# EAGLE design Orone-mini-S8H-v0r001 (EAGLE 6.4)
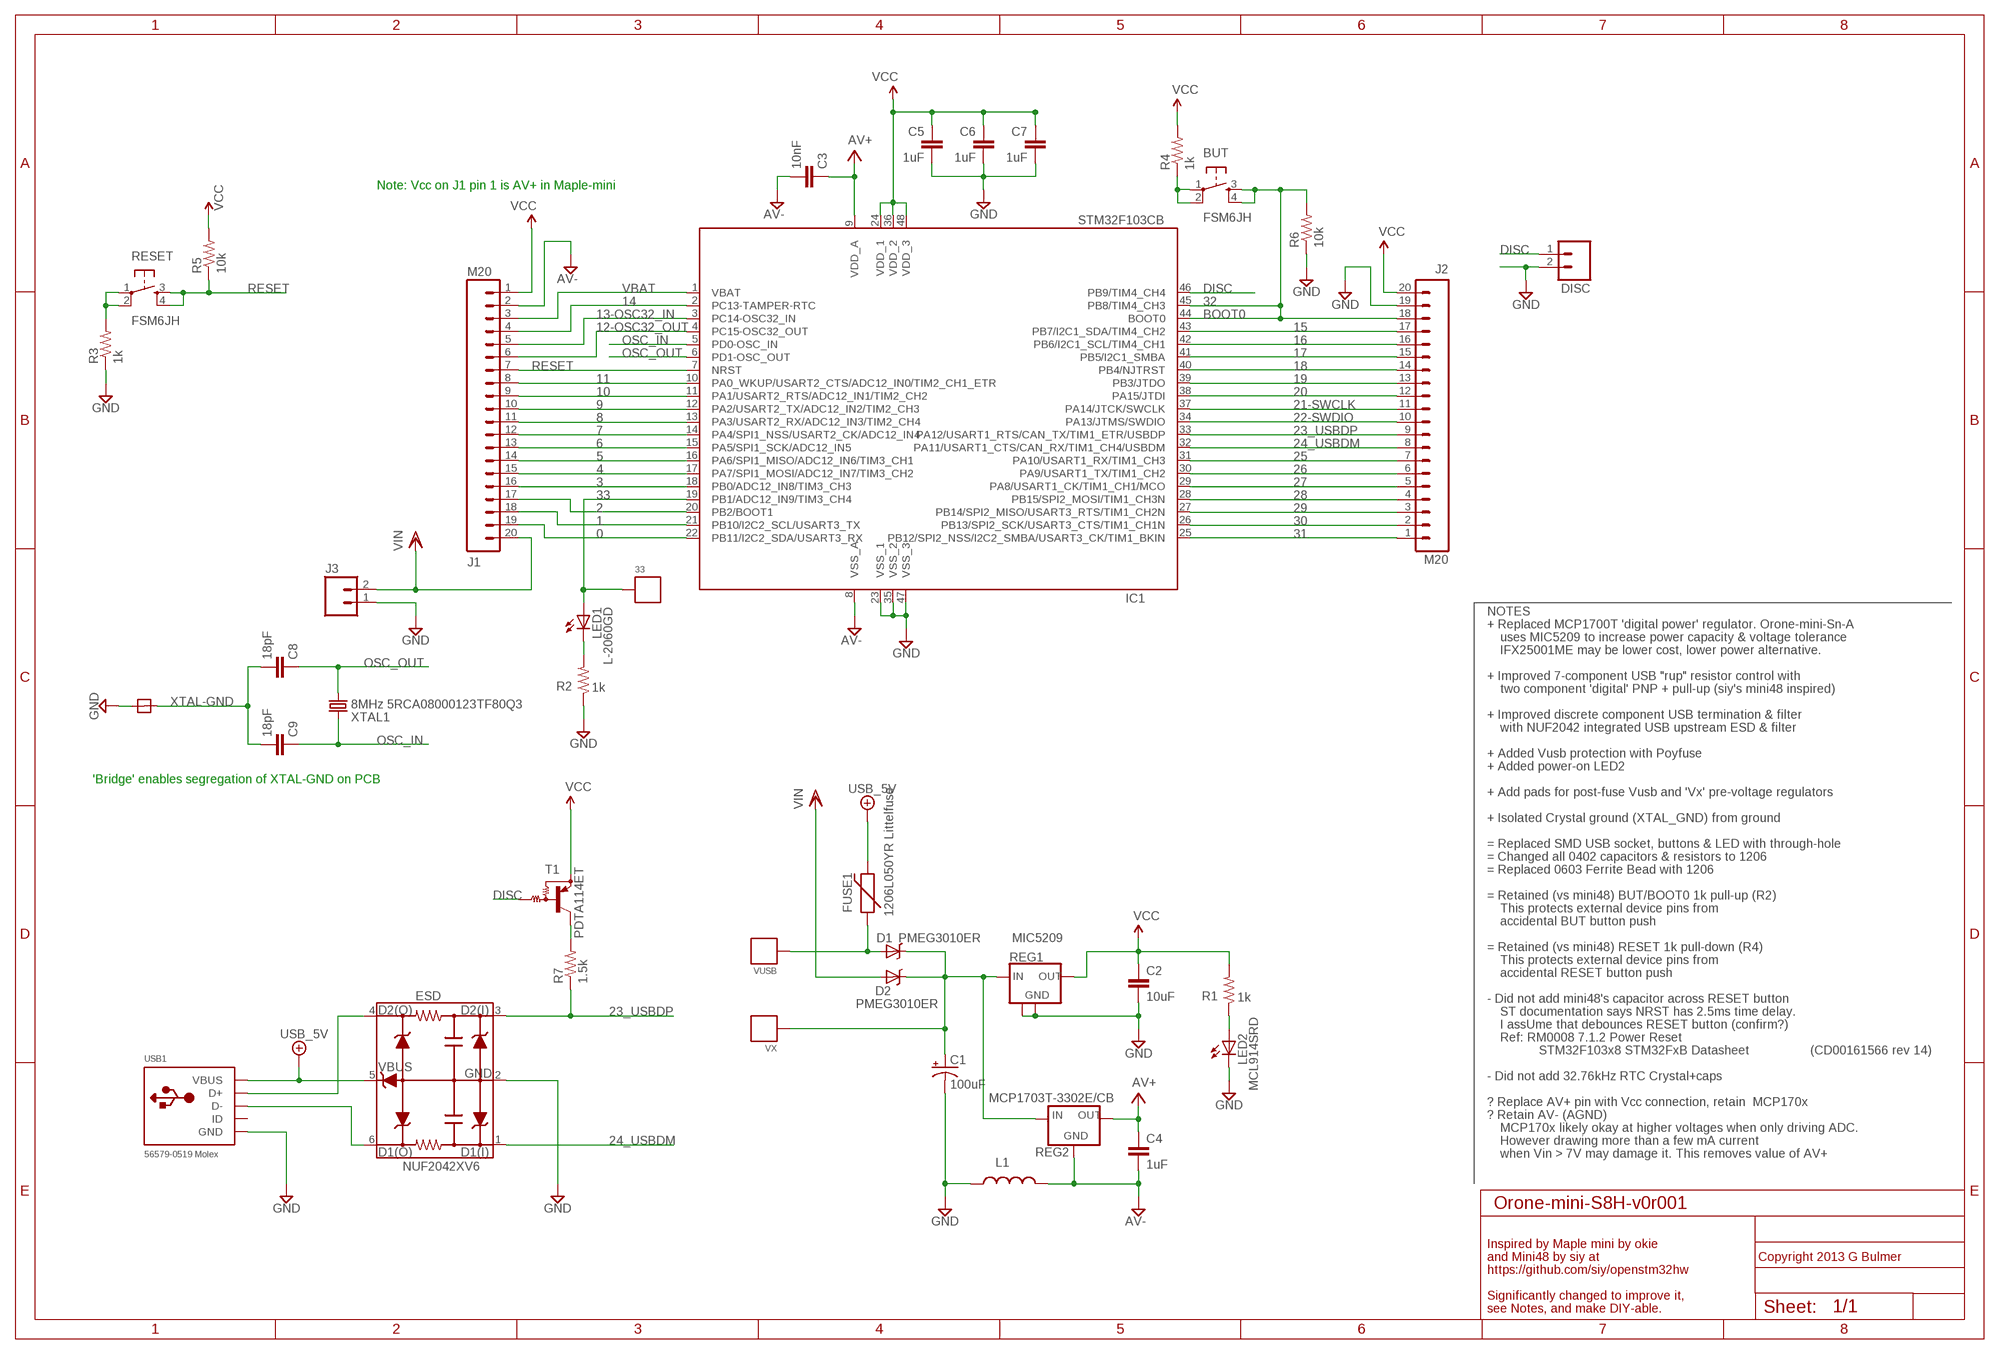
[diagram p0: schematic, sheet 1]

## Parts
33  SIGNAL-PIN1  [1PIN]
BUT  FSM6JH  TAC_SWITCHPTH  [TACTILE-PTH]
C1  100uF  CAP_POL7343  [EIA7343]
C2  10uF  CAP1206  [1206]
C3  10nF  CAP1206  [1206]
C4  1uF  CAP1206  [1206]
C5  1uF  CAP1206  [1206]
C6  1uF  CAP1206  [1206]
C7  1uF  CAP1206  [1206]
C8  18pF  CAP1206  [1206]
C9  18pF  CAP1206  [1206]
D1  PMEG3010ER  DIODE-SCHOTTKYSOD-123W  [SOD-123W]
D2  PMEG3010ER  DIODE-SCHOTTKYSOD-123W  [SOD-123W]
DISC  M021X02_NO_SILK  [1X02_NO_SILK]
ESD  NUF2042XV6  NUF2042XV6SOT563  [SOT563]
FUSE1  1206L050YR Littelfuse  PTCSMD  [PTC-1206]
IC1  STM32F103CB  [LQFP48]
J1  M20  [1X20]
J2  M20  [1X20]
J3  M02POLAR  [MOLEX-1X2]
L1  INDUCTOR1206  [1206]
LED1  L-2060GD  LED1.8MM-1MM  [LED1.8MM-1MM]
LED2  MCL914SRD  LED1.8MM-1MM  [LED1.8MM-1MM]
R1  1k  RESISTOR1206  [1206]
R2  1k  RESISTOR1206  [1206]
R3  1k  RESISTOR1206  [1206]
R4  1k  RESISTOR1206  [1206]
R5  10k  RESISTOR1206  [1206]
R6  10k  RESISTOR1206  [1206]
R7  1.5k  RESISTOR1206  [1206]
REG1  MIC5209  V_REG_LM2937SOT223-NT  [SOT223-NT]
REG2  MCP1703T-3302E/CB  MCP170XSOT23  [SOT23]
RESET  FSM6JH  TAC_SWITCHPTH  [TACTILE-PTH]
T1  PDTA114ET  ES_PNP-DRIVERSOT23-3  [ES_SOT23-3]
U$4  2PIN-GND-BRIDGE08X08MILS  [2PIN-08X08]
USB1  56579-0519 Molex  USB-MINIBTH-DRILL  [USB-MINI-AB-TH-MOLEX-DRILL]
VUSB  SIGNAL-PIN1  [1PIN]
VX  SIGNAL-PIN1  [1PIN]
XTAL1  8MHz 5RCA08000123TF80Q3  CRYSTAL5X3  [CRYSTAL-SMD-5X3]

## Nets
0: IC1.22(PB11/I2C2_SDA/USART3_RX) J1.19
1: IC1.21(PB10/I2C2_SCL/USART3_TX) J1.18
2: IC1.20(PB2/BOOT1) J1.17
3: IC1.18(PB0/ADC12_IN8/TIM3_CH3) J1.16
4: IC1.17(PA7/SPI1_MOSI/ADC12_IN7/TIM3_CH2) J1.15
5: IC1.16(PA6/SPI1_MISO/ADC12_IN6/TIM3_CH1) J1.14
6: IC1.15(PA5/SPI1_SCK/ADC12_IN5) J1.13
7: IC1.14(PA4/SPI1_NSS/USART2_CK/ADC12_IN4) J1.12
8: IC1.13(PA3/USART2_RX/ADC12_IN3/TIM2_CH4) J1.11
9: IC1.12(PA2/USART2_TX/ADC12_IN2/TIM2_CH3) J1.10
10: IC1.11(PA1/USART2_RTS/ADC12_IN1/TIM2_CH2) J1.9
11: IC1.10(PA0_WKUP/USART2_CTS/ADC12_IN0/TIM2_CH1_ETR) J1.8
12-OSC32_OUT: IC1.4(PC15-OSC32_OUT) J1.6
13-OSC32_IN: IC1.3(PC14-OSC32_IN) J1.5
14: IC1.2(PC13-TAMPER-RTC) J1.4
15: IC1.43(PB7/I2C1_SDA/TIM4_CH2) J2.17
16: IC1.42(PB6/I2C1_SCL/TIM4_CH1) J2.16
17: IC1.41(PB5/I2C1_SMBA) J2.15
18: IC1.40(PB4/NJTRST) J2.14
19: IC1.39(PB3/JTDO) J2.13
20: IC1.38(PA15/JTDI) J2.12
21-SWCLK: IC1.37(PA14/JTCK/SWCLK) J2.11
22-SWDIO: IC1.34(PA13/JTMS/SWDIO) J2.10
23_USBDP: ESD.3(D2(I)) IC1.33(PA12/USART1_RTS/CAN_TX/TIM1_ETR/USBDP) J2.9 R7.1
24_USBDM: ESD.1(D1(I)) IC1.32(PA11/USART1_CTS/CAN_RX/TIM1_CH4/USBDM) J2.8
25: IC1.31(PA10/USART1_RX/TIM1_CH3) J2.7
26: IC1.30(PA9/USART1_TX/TIM1_CH2) J2.6
27: IC1.29(PA8/USART1_CK/TIM1_CH1/MCO) J2.5
28: IC1.28(PB15/SPI2_MOSI/TIM1_CH3N) J2.4
29: IC1.27(PB14/SPI2_MISO/USART3_RTS/TIM1_CH2N) J2.3
30: IC1.26(PB13/SPI2_SCK/USART3_CTS/TIM1_CH1N) J2.2
31: IC1.25(PB12/SPI2_NSS/I2C2_SMBA/USART3_CK/TIM1_BKIN) J2.1
32: BUT.3 BUT.4 IC1.44(BOOT0) IC1.45(PB8/TIM4_CH3) J2.18 R6.2
33: 33.P$1 IC1.19(PB1/ADC12_IN9/TIM3_CH4) LED1.A
+5V/2: ESD.5(VBUS) FUSE1.2 USB1.VBUS ; supply symbol labelled USB_5V
AV+: C3.1 C4.1 IC1.9(VDD_A) REG2.2(OUT)
AV-: C3.2 C4.2 IC1.8(VSS_A) J1.2 L1.2 REG2.1(GND)
DGND: C1.C(-) C2.2 C5.2 C6.2 C7.2 DISC.2 ESD.2(GND) IC1.23(VSS_1) IC1.35(VSS_2) IC1.47(VSS_3) J2.19 J3.1 L1.1 LED2.C R2.1 R3.1 R6.1 REG1.2(GND) REG1.4(GND) U$4.P$1 USB1.GND ; supply symbol labelled GND
DISC: DISC.1 IC1.46(PB9/TIM4_CH4) T1.1(B)
N$1: BUT.1 BUT.2 R4.1
N$2: LED1.C R2.2
N$3: D1.P$2.ANODE(A) FUSE1.1 VUSB.P$1
N$4: R3.2 RESET.1 RESET.2
N$6: LED2.A R1.1
N$7: C1.A(+) D1.P$1.CATHODE(C) D2.P$1.CATHODE(C) REG1.1(IN) REG2.3(IN) VX.P$1
N$51: R7.2 T1.3(C)
N$59: ESD.4(D2(O)) USB1.D+
N$60: ESD.6(D1(O)) USB1.D-
OSC_IN: C9.1 IC1.5(PD0-OSC_IN) XTAL1.3
OSC_OUT: C8.1 IC1.6(PD1-OSC_OUT) XTAL1.1
RESET: IC1.7(NRST) J1.7 R5.1 RESET.3 RESET.4
VBAT: IC1.1(VBAT) J1.3
VCC: C2.1 C5.1 C6.1 C7.1 IC1.24(VDD_1) IC1.36(VDD_2) IC1.48(VDD_3) J1.1 J2.20 R1.2 R4.2 R5.2 REG1.3(OUT) T1.2(E)
VIN: D2.P$2.ANODE(A) J1.20 J3.2
XTAL-GND: C8.2 C9.2 U$4.P$2
Unconnected: USB1.ID

## Notes on the sheet
- Note: Vcc on J1 pin 1 is AV+ in Maple-mini
- BOOT0
- NOTES
- + Replaced MCP1700T 'digital power' regulator. Orone-mini-Sn-A
- uses MIC5209 to increase power capacity & voltage tolerance
- IFX25001ME may be lower cost, lower power alternative.
- + Improved 7-component USB "rup" resistor control with
- two component 'digital' PNP + pull-up (siy's mini48 inspired)
- + Improved discrete component USB termination & filter
- with NUF2042 integrated USB upstream ESD & filter
- + Added Vusb protection with Poyfuse
- + Added power-on LED2
- 'Bridge' enables segregation of XTAL-GND on PCB
- + Add pads for post-fuse Vusb and 'Vx' pre-voltage regulators
- + Isolated Crystal ground (XTAL_GND) from ground
- = Replaced SMD USB socket, buttons & LED with through-hole
- = Changed all 0402 capacitors & resistors to 1206
- = Replaced 0603 Ferrite Bead with 1206
- = Retained (vs mini48) BUT/BOOT0 1k pull-up (R2)
- This protects external device pins from
- accidental BUT button push
- = Retained (vs mini48) RESET 1k pull-down (R4)
- This protects external device pins from
- accidental RESET button push
- - Did not add mini48's capacitor across RESET button
- ST documentation says NRST has 2.5ms time delay.
- I assUme that debounces RESET button (confirm?)
- Ref: RM0008 7.1.2 Power Reset
- STM32F103x8 STM32FxB Datasheet | (CD00161566 rev 14)
- - Did not add 32.76kHz RTC Crystal+caps
- ? Replace AV+ pin with Vcc connection, retain  MCP170x
- ? Retain AV- (AGND)
- MCP170x likely okay at higher voltages when only driving ADC.
- However drawing more than a few mA current
- when Vin > 7V may damage it. This removes value of AV+
- Inspired by Maple mini by okie
- and Mini48 by siy at | Copyright 2013 G Bulmer
- https://github.com/siy/openstm32hw
- Significantly changed to improve it,
- see Notes, and make DIY-able.

## Library data of the parts
33 VUSB VX = signal-pins:SIGNAL-PIN1
BUT RESET = SparkFun:TAC_SWITCH: Momentary Switch Button commonly used for reset or general input. Spark Fun Electronics SKU : COM-00097
C1 = SparkFun:CAP_POL: Capacitor Polarized These are standard SMD and PTH capacitors. Normally 10uF, 47uF, and 100uF in electrolytic and tantalum varieties. Always verify the external diameter of the through hole cap, it varies with capacity, voltage, and manufacturer. The EIA devices should be standard.
C2-C9 = SMD-passives-gb01:CAP: Capacitor Standard 1206 SMD ceramic capacitor
D1 D2 = diode-schottky:DIODE-SCHOTTKY
DISC J3 = SparkFun:M02: Header 2 Standard 2-pin 0.1" header. Use with straight break away headers (SKU : PRT-00116), right angle break away headers (PRT-00553), swiss pins (PRT-00743), machine pins (PRT-00117), and female headers (PRT-00115). Molex polarized connector foot print use with SKU : PRT-08233 with associated crimp pins and housings.
ESD = USB-ESD-protection:NUF2042XV6: NUF2042XV6 - USB ESD protection, and Full-speed USB termination. Resistor values are 22ohm. Capacitor values are 42pF.
FUSE1 = SparkFun:PTC: Resettable Fuse PTC Resettable Fuse. Spark Fun Electronics SKU : COM-08357
IC1 = stm32:STM32F103CB
J1 J2 = SparkFun:M20: 20 pin Header Contains both standard and LOCK variants. The lock_special holes are staggared by 5 mil, like the lock variant, except for the last two holes. They are not altered from the "standard" footprint layout. This is used for a special purpose on the layout of our Graphic LCD Backpack. Make sure you want to use this device before selecting it for you project!
L1 = SMD-passives-gb01:INDUCTOR: Inductors This is Sparkfun's Inductor, using the standard resistor/capacitor footprint. It has not been proven. The 1206 footprint also matches the Ferrite Bead footprint for fair-rite at fair-rite.com was http://www.fair-rite.com/cgibin/catalog.pgm?THEAPPL=Suppression+Components&THEWHERE=Board+Component&THEPART=Chip+Beads#select:freq1
LED1 LED2 = LED:LED: LEDs Standard schematic elements and footprints for 5mm, 3mm, 1206, and 0603 sized LEDs. 5mm - Spark Fun Electronics SKU : COM-00529 (and others)
R1-R7 = SMD-passives-gb01:RESISTOR: Resistor Basic schematic elements and footprints for 0603, 1206, and PTH resistors.
REG1 = V_REG_LM2937:V_REG_LM2937: LM2937-footprint LDO Voltage regulator LM2937 500mA minimum 4.75V in 3.3V out: http://www.ti.com/product/lm2937-3.3 or http://www.ti.com/product/lm2937 MIC5209 500mA, 600mV@0.5A dropout voltage (max): http://www.micrel.com/_PDF/mic5209.pdf MIC39100 1A, 630mV@1A dropout voltage (max): http://www.micrel.com/_PDF/mic39100.pdf
REG2 = MCP170x:MCP170X: Microchip MCP170x voltage regulator MCP1702 http://ww1.microchip.com/downloads/en/DeviceDoc/22008E.pdf MCP1703 http://ww1.microchip.com/downloads/en/DeviceDoc/22049f.pdf
T1 = pnp_digital_transistor:ES_PNP-DRIVER
U$4 = senzate-2010-02:2PIN-GND-BRIDGE
USB1 = USB-Mini-Molex:USB-MINIB: USB Connectors USBMINIB Thru-hole Mini-AB Molex RA TH-SLOT is Molex part # 56579-0576 (gbulmer) - Untested Thru-hole Mini-AB Molex RA TH-DRILL is Molex part # 56579-0576 **CHECK WITH PCB Maker close-drilling of holes is okay (gbulmer) - Untested Thru-hole Mini-B RA MULTICOMP-TH is a Multicomp MC32599 from Farnell.com (gbulmer) - Untested
XTAL1 = SparkFun2:CRYSTAL: Crystals Various standard crystals. Proven footprints. Spark Fun Electronics SKU : COM-00534

## Net classes
1 vcc: width 0.254 mm

## Board
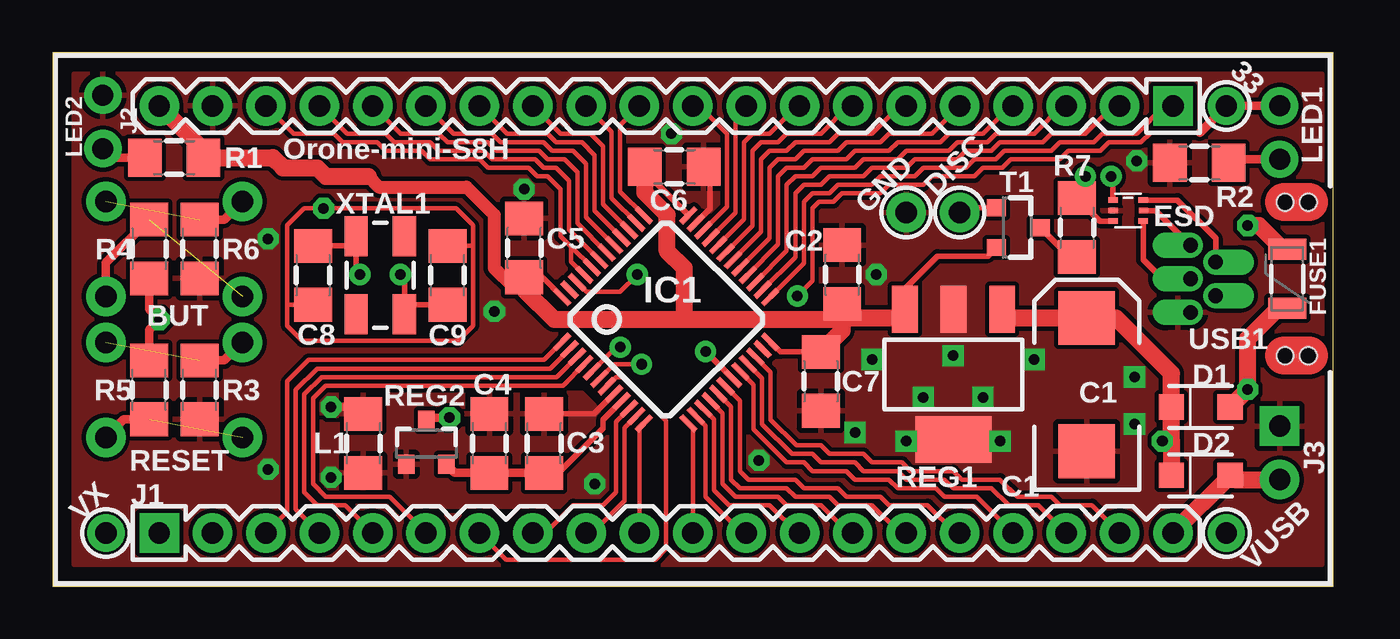
[diagram p1: board, top side]
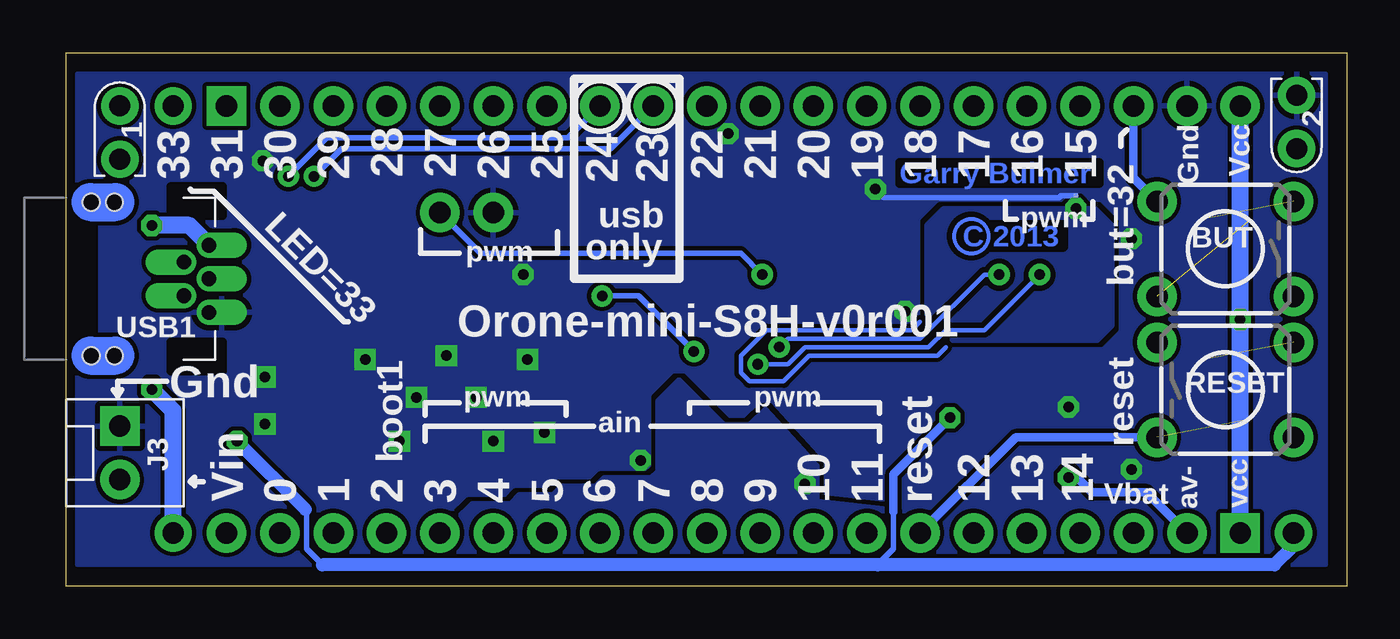
[diagram p2: board, bottom side, seen from below]

Size 60.96 x 25.4 mm. Coordinates in mm from the lower left corner, seen from the top.
Outline: 0,0 60.96,0 60.96,25.4 0,25.4 0,0
Copper layers (1*16): Top 0.0356mm / dielectric 1.5011mm / Bottom 0.0356mm
Design rules "Orone-mini *": minimum track width 0.2mm, minimum drill 0.5mm, track to track 8mil, track to pad 8mil, pad to pad 8mil, via to via 8mil, smd to smd 8mil, copper to edge 16mil, drill to drill 8mil, minimum pad ring 10mil, minimum via ring 10mil, stop-mask expansion 4mil, vias tented up to drill 20mil, thermal gap 10mil
tRestrict: 1 lines

### Footprints (pad centres in the part's own frame; a part is rotated, then mirrored left to right if it is on the bottom)
1PIN = drill 1.016 pad 1.778: P$1 0,0
TACTILE-PTH = drill 1.016 pad 1.88: 1 -3.251,2.261; 2 3.251,2.261; 3 -3.251,-2.261; 4 3.251,-2.261
EIA7343 = smd 2.55 x 2.7: A 3.17,0; C -3.17,0
1206 = smd 1.6 x 1.8: 1 -1.4,0; 2 1.4,0
SOD-123W = smd 1.2 x 1.2: P$1.CATHODE -1.4,0; P$2.ANODE 1.4,0
1X02_NO_SILK = drill 1.016 pad 1.88: 1 0,0; 2 2.54,0
SOT563 = smd 0.25 x 0.45: 1 -0.5,-0.72; 2 0,-0.72; 3 0.5,-0.72; 4 0.5,0.72; 6 -0.5,0.72 | smd 0.25 x 0.44: 5 0,0.72
PTC-1206 = smd 1 x 1.8: 1 -1.4,0; 2 1.4,0
LQFP48@1 = smd 0.254 x 1: 1 -2.75,-4.25; 2 -2.25,-4.25; 3 -1.75,-4.25; 4 -1.25,-4.25; 5 -0.75,-4.25; 6 -0.25,-4.25; 7 0.25,-4.25; 8 0.75,-4.25; 9 1.25,-4.25; 10 1.75,-4.25; 11 2.25,-4.25; 12 2.75,-4.25; 25 2.75,4.25; 26 2.25,4.25; 27 1.75,4.25; 28 1.25,4.25; 29 0.75,4.25; 30 0.25,4.25; 31 -0.25,4.25; 32 -0.75,4.25; 33 -1.25,4.25; 34 -1.75,4.25; 35 -2.25,4.25; 36 -2.75,4.25 | smd 1 x 0.254: 13 4.25,-2.75; 14 4.25,-2.25; 15 4.25,-1.75; 16 4.25,-1.25; 17 4.25,-0.75; 18 4.25,-0.25; 19 4.25,0.25; 20 4.25,0.75; 21 4.25,1.25; 22 4.25,1.75; 23 4.25,2.25; 24 4.25,2.75; 37 -4.25,2.75; 38 -4.25,2.25; 39 -4.25,1.75; 40 -4.25,1.25; 41 -4.25,0.75; 42 -4.25,0.25; 43 -4.25,-0.25; 44 -4.25,-0.75; 45 -4.25,-1.25; 46 -4.25,-1.75; 47 -4.25,-2.25; 48 -4.25,-2.75
1X20 = drill 1.016 pad 1.88 square: 1 0,0 | drill 1.016 pad 1.88: 2 2.54,0; 3 5.08,0; 4 7.62,0; 5 10.16,0; 6 12.7,0; 7 15.24,0; 8 17.78,0; 9 20.32,0; 10 22.86,0; 11 25.4,0; 12 27.94,0; 13 30.48,0; 14 33.02,0; 15 35.56,0; 16 38.1,0; 17 40.64,0; 18 43.18,0; 19 45.72,0; 20 48.26,0
MOLEX-1X2 = drill 1.016 pad 1.88 square: 1 0,0 | drill 1.016 pad 1.88: 2 2.54,0
LED1.8MM-1MM = drill 1 pad 1.778: A 0,1.27; C 0,-1.27
SOT223-NT = smd 1.219 x 2.235: 1 -2.311,-3.099; 2 0,-3.099; 3 2.311,-3.099 | smd 3.6 x 2.2: 4 0,3.099
SOT23 = smd 0.8 x 0.9: 1 -0.95,-1; 2 0.95,-1; 3 0,1.1
ES_SOT23-3 = smd 0.8 x 0.9: 1 -0.95,-1; 2 0.95,-1; 3 0,1.1
2PIN-08X08 = smd 0.203 x 0.203: P$1 -0.102,0; P$2 0.102,0
USB-MINI-AB-TH-MOLEX-DRILL = drill 0.7 offset: D+ 1.2,0; D- 0,0.8; GND 1.2,-1.6; ID 0,-0.8; VBUS 1.2,1.6 | hole 0.8: -4.4,3.65; -3.3,3.65; -4.4,-3.65; -3.3,-3.65
CRYSTAL-SMD-5X3 = smd 1.9 x 1.1: 1 -1.85,-1.15; 2 1.85,-1.15; 3 1.85,1.15; 4 -1.85,1.15

### Placement (x,y rotation side)
33  55.88,22.86 0 top
BUT  5.79,16.05 180 bottom
C1  49.23,9.59 90 top
C2  37.59,14.83 90 top
C3  23.4,6.8 90 top
C4  20.8,6.8 90 top
C5  22.45,16.1 90 top
C6  29.6,19.96 0 top
C7  36.58,9.75 270 top
C8  12.4,14.8 270 top
C9  18.8,14.8 90 top
D1  54.66,8.53 0 top
D2  54.66,5.28 0 top
DISC  43.18,17.78 180 top
ESD  51.21,17.88 270 top
FUSE1  58.78,14.63 90 top
IC1  STM32F103CB  [LQFP48@1]  29.21,12.7 315 top
J1  5.08,2.54 0 top
J2  53.34,22.86 180 top
J3  58.42,7.62 270 bottom
L1  14.79,6.8 270 top
LED1  58.42,21.59 0 bottom
LED2  2.4,22.1 180 bottom
R1  5.79,20.4 0 top
R2  54.59,20.15 0 top
R3  7,9.35 90 top
R4  4.6,16.05 270 top
R5  4.6,9.35 90 top
R6  7,16.05 90 top
R7  48.77,17.07 270 top
REG1  42.89,10.08 180 top
REG2  17.79,6.8 0 top
RESET  5.79,9.35 0 bottom
T1  45.92,17.07 270 top
U$4  12.9,18.49 270 bottom
USB1  55.37,14.63 0 bottom
VUSB  55.88,2.54 0 top
VX  2.54,2.54 0 top
XTAL1  15.6,14.8 270 top

### Tracks (layer width: path | path; a pad name or v marks a point on that pad's centre or on a via)
0
  Top 0.203: IC1.22 34.19,10.2 34.19,7.92 35.41,6.71 36.58,6.71 36.98,6.3 38.61,6.3 39.01,5.89 40.44,5.89 40.84,5.49 42.88,5.49 43.28,5.08 45.11,5.08 45.92,4.27 47.55,4.27 47.95,3.86 49.48,3.86 J1.19
1
  Top 0.203: J1.18 46.94,3.86 45.52,3.86 44.7,4.67 42.88,4.67 42.47,5.08 40.64,5.08 40.23,5.49 38.61,5.49 38.2,5.89 36.58,5.89 36.17,6.3 35.2,6.3 33.78,7.72 33.78,9.9 IC1.21
2
  Top 0.203: IC1.20 33.38,9.6 33.38,7.47 34.95,5.89 35.76,5.89 36.17,5.49 37.8,5.49 38.2,5.08 39.83,5.08 40.23,4.67 42.06,4.67 42.47,4.27 43.99,4.27 J1.17
3
  Top 0.203: IC1.18 32.72,8.84 32.72,5.49 33.12,5.08 35.36,5.08 35.76,4.67 37.39,4.67 37.8,4.27 39.42,4.27 39.83,3.86 41.66,3.86 42.98,2.54 J1.16
4
  Top 0.203: IC1.17 32.31,8.54 32.31,5.08 32.72,4.67 34.95,4.67 35.36,4.27 36.98,4.27 37.39,3.86 39.01,3.86 40.34,2.54 J1.15
5
  Top 0.203: IC1.16 31.9,8.24 31.9,4.88 32.51,4.27 34.54,4.27 34.95,3.86 36.58,3.86 37.9,2.54 J1.14
6
  Top 0.203: IC1.15 31.5,7.94 31.5,4.57 32.21,3.86 34.14,3.86 35.46,2.54 J1.13
7
  Top 0.203: IC1.14 31.09,7.64 31.09,4.27 32.82,2.54 J1.12
8
  Top 0.203: IC1.13 30.48,7.54 J1.11
9
  Top 0.203: IC1.12 27.94,7.54 J1.10
10
  Top 0.203: IC1.11 27.23,7.54 27.23,4.06 25.7,2.54 J1.9
11
  Top 0.203: IC1.10 26.82,7.84 26.82,4.47 26.21,3.86 24.79,3.86 23.47,2.54 J1.8
12-OSC32_OUT
  Top 0.203: IC1.4 24.29,9.55 13.01,9.55 12.39,8.94 12.39,4.88 13.01,4.27 16.05,4.27 J1.6
13-OSC32_IN
  Top 0.203: IC1.3 23.99,9.96 12.8,9.96 11.99,9.14 11.99,4.47 12.6,3.86 13.92,3.86 J1.5
14
  Top 0.203: IC1.2 23.69,10.36 12.6,10.36 11.58,9.35 11.58,3.66 J1.4
15
  Top 0.203: IC1.43 24.59,16.97 24.59,19.3 23.98,19.91 23.37,19.91 22.96,20.32 20.93,20.32 20.52,20.73 18.39,20.73 17.98,21.13 16.26,21.13 15.85,21.54 14.02,21.54 J2.17
16
  Top 0.203: IC1.42 24.99,17.27 24.99,19.71 24.38,20.32 23.57,20.32 23.16,20.73 21.13,20.73 20.73,21.13 18.8,21.13 18.39,21.54 16.56,21.54 J2.16
17
  Top 0.203: IC1.41 25.4,17.57 25.4,20.12 24.79,20.73 23.77,20.73 23.37,21.13 21.34,21.13 20.93,21.54 19.1,21.54 J2.15
18
  Top 0.203: IC1.40 25.81,17.87 25.81,20.52 25.2,21.13 23.98,21.13 23.57,21.54 21.64,21.54 J2.14
19
  Top 0.203: IC1.39 26.21,18.17 26.21,20.93 25.6,21.54 24.18,21.54 J2.13
20
  Top 0.203: IC1.38 26.62,18.47 26.62,21.64 J2.12
21-SWCLK
  Top 0.203: IC1.37 27.03,18.77 27.03,21.95 J2.11
22-SWDIO
  Top 0.203: IC1.34 32.11,18.07 32.11,21.54 30.79,22.86 J2.10
23_USBDP  (via drill 0.5)
  Top 0.203: IC1.33 32.51,17.77 32.51,22.35 J2.9
  Top 0.254: ESD.3 49.85,17.38 R7.1 48.77,19.1 v49.17,19.51
  Bottom 0.254: J2.9 35.05,20.83 47.85,20.83 v49.17,19.51
24_USBDM  (via drill 0.5)
  Top 0.203: IC1.32 32.92,17.47 32.92,21.13 33.33,21.54 34.14,21.54 35.46,22.86 J2.8
  Top 0.254: ESD.1 50.49,19.41 v50.39,19.51
  Bottom 0.254: J2.8 37.08,21.34 48.56,21.34 v50.39,19.51
25
  Top 0.203: IC1.31 33.33,17.17 33.33,20.73 33.73,21.13 34.54,21.13 34.95,21.54 36.58,21.54 37.9,22.86 J2.7
26
  Top 0.203: IC1.30 33.73,16.87 33.73,20.32 34.14,20.73 34.95,20.73 35.36,21.13 36.98,21.13 37.39,21.54 39.01,21.54 40.34,22.86 J2.6
27
  Top 0.203: IC1.29 34.14,16.57 34.14,19.91 34.54,20.32 35.36,20.32 35.76,20.73 37.39,20.73 37.8,21.13 39.42,21.13 39.83,21.54 41.86,21.54 J2.5
28
  Top 0.203: IC1.28 34.54,16.27 34.54,19.51 34.95,19.91 35.76,19.91 36.17,20.32 37.8,20.32 38.2,20.73 39.83,20.73 40.23,21.13 42.27,21.13 42.67,21.54 44.3,21.54 45.62,22.86 J2.4
29
  Top 0.203: IC1.27 34.95,15.97 34.95,19.1 35.36,19.51 36.17,19.51 36.58,19.91 38.2,19.91 38.61,20.32 40.23,20.32 40.64,20.73 42.67,20.73 43.08,21.13 44.5,21.13 44.91,21.54 46.74,21.54 48.06,22.86 J2.3
30
  Top 0.203: IC1.26 35.36,15.66 35.36,18.69 35.76,19.1 36.58,19.1 36.98,19.51 38.61,19.51 39.01,19.91 40.64,19.91 41.05,20.32 43.08,20.32 43.48,20.73 44.7,20.73 45.11,21.13 47.14,21.13 47.55,21.54 49.17,21.54 50.49,22.86 J2.2
31
  Top 0.203: IC1.25 35.76,15.36 35.76,18.29 36.17,18.69 36.98,18.69 37.39,19.1 39.01,19.1 39.42,19.51 41.05,19.51 41.45,19.91 43.48,19.91 43.89,20.32 44.91,20.32 45.31,20.73 47.55,20.73 47.95,21.13 49.58,21.13 49.99,21.54 51.61,21.54 52.93,22.86 J2.1
32  (1 unrouted)
  Top 0.203: 24.69,16.16 24.18,16.67 24.18,18.9 23.57,19.51 23.06,19.51 22.66,19.91 20.73,19.91 20.32,20.32 17.98,20.32 17.58,20.73 15.85,20.73 15.44,21.13 13.82,21.13 13.41,21.54 11.48,21.54 J2.18 | 24.69,16.16 IC1.44 | IC1.45 24.69,15.45 24.69,16.16
  Top 0.406: R6.2 8.18,17.45 BUT.4
  Bottom 0.406: BUT.4 10.16,19.43 J2.18
33  (via drill 0.5)
  Top 0.203: 54.61,21.59 52.27,21.59 51.82,21.13 50.29,21.13 49.89,20.73 48.36,20.73 47.95,20.32 45.62,20.32 45.21,19.91 44.3,19.91 43.89,19.51 41.86,19.51 41.45,19.1 39.83,19.1 39.42,18.69 37.59,18.69 37.19,18.29 36.47,18.29 36.17,17.98 36.17,14.53 v35.46,13.82
  Top 0.254: IC1.19 v31.09,11.17 v31.09,11.18
  Top 0.406: 54.61,21.59 33.P$1 | 33.P$1 55.98,22.86 | 33.P$1 LED1.A
  Bottom 0.254: v35.46,13.82 33.73,13.82 v31.09,11.18
+5V/2  (via drill 0.5)
  Top 0.254: ESD.5 52.52,17.88 USB1.VBUS
  Top 0.813: v56.9,17.17 57.43,17.17 58.57,16.03 FUSE1.2
  Bottom 0.813: USB1.VBUS 55.11,17.17 v56.9,17.17
AV+
  Top 0.254: 23.68,5.4 C3.1 24.09,5.4 26.21,7.52 26.21,7.93 IC1.9
  Top 0.406: 23.68,5.4 C4.1 19.14,5.4 REG2.2
AV-  (via drill 0.5)
  Top 0.254: IC1.8 25.77,8.2 C3.2
  Bottom 0.406: J1.2 9.55,4.47 12.14,4.47 12.85,5.18 v13.26,5.18
  other vias: 25.81,4.88
  pour Top: 12.39,9.2 25.21,9.2 26.4,8.01 26.4,3.79 12.39,3.79
  pour Bottom: 31.8,9.86 32.82,8.84 32.82,5.49 33.12,5.18 35.36,5.18 35.76,4.78 37.39,4.78 37.8,4.37 39.42,4.37 39.83,3.96 41.66,3.96 43.23,2.44 43.23,1.07 21.64,1.07 21.64,3.66 25.2,4.06 25.22,5.73 27.68,8.44 28.45,7.72 29.67,7.72
DGND  (via drill 0.5)
  Top 0.254: IC1.35 31.29,17.96 31.29,19.51 31,19.8 C6.2
  Top 0.406: L1.1 14.46,8.53 v13.26,8.53
  Bottom 0.254: U$4.P$1 13.61,18.6 13.72,18.49 22.05,18.49 v22.45,18.9
  other vias: 29.46,21.54 42.88,10.97 51.51,9.96 44.3,8.99 41.45,8.99 51.51,7.72 40.64,6.91 45.11,6.91 39.22,14.83 39.01,10.79 46.74,10.79 33.63,5.99 38.2,7.32 21.03,13.08 51.61,20.24 10.26,5.56 10.26,16.54
  pour Bottom (isolate 0.203, rank 2): 1.02,1.02 60.45,1.02 60.45,24.38 1.02,24.38
  pour Top (isolate 0.203, rank 2): 1.02,1.02 60.45,1.02 60.45,24.38 1.02,24.38
  pour Top: 24.59,13.21 28.85,17.48 29.67,17.48 33.93,13.21 33.93,12.19 29.67,7.92 28.85,7.92 24.59,12.19
DISC  (via drill 0.5)
  Top 0.203: IC1.46 25.41,14.02 27.03,14.02 v27.84,14.83
  Top 0.254: T1.1 43.42,18.02 DISC.1
  Bottom 0.254: v27.84,14.83 28.85,15.85 41.25,15.85 DISC.1
N$1  (1 unrouted)
  Top 0.406: BUT.1 2.54,15.39 R4.1
N$2
  Top 0.406: LED1.C 55.99,20.32 R2.2
N$3  (via drill 0.5)
  Top 0.813: FUSE1.1 58.34,13.23 56.9,11.79 v56.9,9.37 D1.P$2.ANODE
  Bottom 0.813: VUSB.P$1 55.88,8.35 v56.9,9.37
N$4  (1 unrouted)
  Top 0.406: RESET.1 8.18,10.75 R3.2
N$6
  Top 0.406: R1.1 2.83,20.4 LED2.A
N$7  (via drill 0.5)
  Top 0.406: REG2.3 17.92,8.03 v18.9,8.03
  Top 0.813: REG1.1 45.61,12.77 C1.A 50.63,12.77 53.26,10.14 D1.P$1.CATHODE 53.26,6.91 | 53.26,6.91 D2.P$1.CATHODE | v52.83,6.91 53.26,6.91
  Bottom 0.254: 21.59,3.56 21.59,1.78 22.35,1.02 | 48.77,1.02 49.53,1.78 49.53,3.61 49.58,3.66
  Bottom 0.406: v18.9,8.03 21.59,5.33 21.59,3.56
  Bottom 0.61: 48.77,1.02 22.35,1.02 3.45,1.02 2.54,1.93 VX.P$1 | 49.58,3.66 v52.83,6.91
N$51
  Top 0.254: T1.3 48.42,15.67 R7.2
N$59
  Top 0.254: USB1.D+ 52.83,14.63 51.93,15.54 ESD.4
N$60
  Top 0.254: USB1.D- 55.37,16.56 53.55,18.38 ESD.6
OSC_IN  (via drill 0.5)
  Top 0.203: IC1.5 26.83,11.38 v27.03,11.38
  Top 0.254: v16.56,14.83 16.75,14.64 XTAL1.3 17.2,13.4 C9.1
  Bottom 0.203: v16.56,14.83 17.27,14.83 20.32,11.79 26.62,11.79 v27.03,11.38
OSC_OUT  (via drill 0.5)
  Top 0.203: v28.04,10.57 26.72,10.57 IC1.6
  Top 0.254: C8.1 14,16.2 XTAL1.1 14.45,15.01 v14.63,14.83
  Bottom 0.203: v14.63,14.83 17.27,12.19 19.1,12.19 19.91,11.38 25.81,11.38 26.62,10.57 v28.04,10.57
RESET  (1 unrouted)
  Top 0.203: IC1.7 26.82,9.96 27.13,9.96 29.21,7.87 29.21,1.78 28.7,1.27 21.59,1.27 J1.7
  Top 0.406: RESET.4 3.4,7.95 R5.1
  Bottom 0.406: RESET.3 15.77,7.09 J1.7
VBAT
  Top 0.203: IC1.1 23.39,10.77 12.19,10.77 11.18,9.75 11.18,3.56 J1.3
VCC  (via drill 0.5)
  Top 0.254: 23.73,14.29 IC1.48 23.32,14.7 C5.1 | IC1.24 34.65,11.15 C7.1 | REG1.3 40.58,14.16 42.13,15.71 44.52,15.71 T1.2 | IC1.36 28.2,19.72 C6.1
  Top 0.406: R5.2 4.6,12.22 v5.08,12.7 4.6,13.18 R4.2
  Top 0.61: 15.04,19.51 15.54,19 19.71,19 21.03,17.68 21.03,15.14 21.87,14.3 22.38,14.3 22.45,14.22
  Top 0.813: C6.1 28.2,18.74 29.26,17.68 29.26,15.95 30.07,15.14 30.07,12.7 | 15.04,19.51 13.01,19.51 12.6,19.91 10.97,19.91 10.49,20.4 R1.2 7.19,20.75 J2.20 | 30.07,12.7 23.88,12.7 22.45,14.12 22.45,14.22 C5.1 | REG1.3 40.58,12.77 37.59,12.77 C2.1 37.59,12.7 | 30.07,12.7 37.59,12.7 | C7.1 37.59,12.17 37.59,12.7
  Bottom 0.813: J2.20 v5.08,12.7 J1.1
VIN
  Top 0.813: J1.20 56.06,5.26 D2.P$2.ANODE 56.26,5.08 J3.2
XTAL-GND  (via drill 0.5)
  Top 0.203: 11.18,13.4 C8.2 | 11.18,13.4 11.18,17.17 11.99,17.98 12.5,17.98 | 20.02,16.2 C9.2 | 20.02,16.2 20.02,17.17 19.2,17.98 v12.9,17.98 | 11.18,13.4 11.18,12.39 11.89,11.68 19.3,11.68 20.02,12.39 20.02,16.2
  Bottom 0.203: v12.9,17.98 U$4.P$2
  pour Bottom (isolate 0.254): 19.2,17.98 11.99,17.98 11.18,17.17 11.18,12.4 11.89,11.68 19.3,11.68 20.02,12.4 20.02,17.17
XTAL-GUARD-INTENDED
  Bottom 0.203: 20.32,12.6 20.73,12.19 27.64,12.19 28.85,10.97 28.85,10.16 28.45,9.75 26.82,9.75 25.6,10.97 19.51,10.97 19.1,11.38
(copper drawn outside any net)
  shapes: Bottom circle x1

### Text on the board
Bottom: Garry Bulmer | C 2013
bPlace: 2 | Vcc | Gnd | 15 | 16 | 17 | 18 | 19 | 20 | 21 | 22 | 23 | 24 | 25 | 26 | 27 | 28 | 29 | 30 | 31 | 33 | 1 | pwm | usb | LED=33 | only | pwm | but=32 | Gnd | pwm | pwm | reset | ain | boot1 | vcc | av- | Vbat | 14 | 13 | 12 | reset | 11 | 10 | 9 | 8 | 7 | 6 | 5 | 4 | 3 | 2 | 1 | 0 | Vin
tNames: Orone-mini-S8H | GND | BUT | USB1 | C1 | J3 | RESET
Document: 8mil
tDocu: Ground | Heatsink